# Altium schematic sheet Navigation.SchDoc
size A
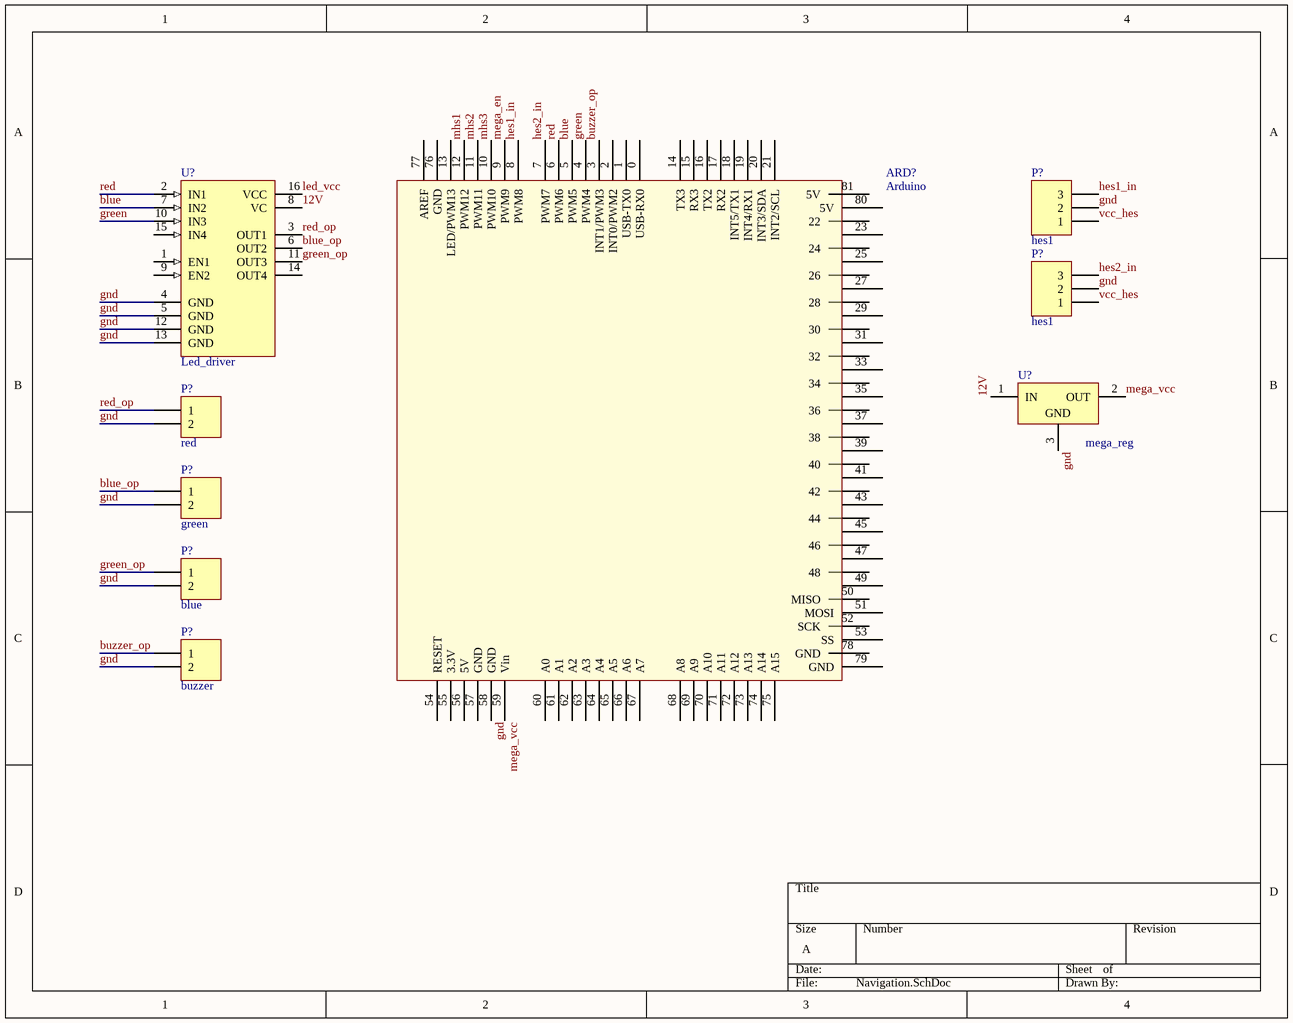
[diagram p0: Navigation.SchDoc]

## Parts
(Parts that share a designator on the sheet are numbered #1, #2 ... from top to bottom, then left to right.)
ARD?  Arduino  [Arduino]
P?#1  hes1  [HDR1X3H]
P?#2  hes1  [HDR1X3H]
P?#3  red  [HDR1X2H]
P?#4  green  [HDR1X2H]
P?#5  blue  [HDR1X2H]
P?#6  buzzer  [HDR1X2H]
U?#1  Led_driver  [DIP16]
U?#2  mega_reg  [TO220ABN]

## Nets
12V: U?#1.8(VC) U?#2.1(IN)
blue: ARD?.5(PWM5) U?#1.7(IN2)
blue_op: P?#4.1 U?#1.6(OUT2)
buzzer_op: ARD?.3(INT1/PWM3) P?#6.1
gnd: ARD?.58(GND) P?#1.2 P?#2.2 P?#3.2 P?#4.2 P?#5.2 P?#6.2 U?#1.4(GND) U?#1.5(GND) U?#1.12(GND) U?#1.13(GND) U?#2.3(GND)
green: ARD?.4(PWM4) U?#1.10(IN3)
green_op: P?#5.1 U?#1.11(OUT3)
hes1_in: ARD?.8(PWM8) P?#1.3
hes2_in: ARD?.7(PWM7) P?#2.3
led_vcc: U?#1.16(VCC)
mega_en: ARD?.9(PWM9)
mega_vcc: ARD?.59(Vin) U?#2.2(OUT)
mhs1: ARD?.12(PWM12)
mhs2: ARD?.11(PWM11)
mhs3: ARD?.10(PWM10)
red: ARD?.6(PWM6) U?#1.2(IN1)
red_op: P?#3.1 U?#1.3(OUT1)
vcc_hes: P?#1.1 P?#2.1

Not connected (* = marked no-connect by the designer): ARD? 0(USB-RX0) 1(USB-TX0) 2(INT0/PWM2) 13(LED/PWM13) 14(TX3) 15(RX3) 16(TX2) 17(RX2) 18(INT5/TX1) 19(INT4/RX1) 20(INT3/SDA) 21(INT2/SCL) 22 23 24 25 26 27 28 29 30 31 32 33 34 35 36 37 38 39 40 41 42 43 44 45 46 47 48 49 50(MISO) 51(MOSI) 52(SCK) 53(SS) 54(RESET) 55(3.3V) 56(5V) 57(GND) 60(A0) 61(A1) 62(A2) 63(A3) 64(A4) 65(A5) 66(A6) 67(A7) 68(A8) 69(A9) 70(A10) 71(A11) 72(A12) 73(A13) 74(A14) 75(A15) 76(GND) 77(AREF) 78(GND) 79(GND) 80(5V) 81(5V); U?#1 1(EN1) 9(EN2) 14(OUT4) 15(IN4)

## Library data of the parts
P?#1 P?#2 = Header 3H: Header, 3-Pin, Right Angle; LatestRevisionDate: 17-Jul-2002; LatestRevisionNote: Re-released for DXP Platform.; Publisher: Altium Limited
P?#3-P?#6 = Header 2H: Header, 2-Pin, Right Angle; LatestRevisionDate: 17-Jul-2002; LatestRevisionNote: Re-released for DXP Platform.; Publisher: Altium Limited
U?#1 = L293D: Push-Pull Four Channel Driver With Diode; Published: 8-Jun-2000; LatestRevisionDate: 06-Jun-2005; LatestRevisionNote: Stylized 3D Model Added.; DatasheetVersion: Jun-1996; PackageVersion: Apr-1996; PackageReference: DIP16; Publisher: Altium Limited; PackageDescription: DIP; 16 Leads; Row Spacing 7.62 mm; Pitch 2.54 mm; ComponentLink1Description: Manufacturer Link; ComponentLink1URL: http://www.st.com/; ComponentLink2Description: Datasheet; ComponentLink2URL: http://www.st.com/stonline/products/literature/ds/1330/l293d.pdf
U?#2 = L7805CV: Positive Voltage Regulator; Note: Tab is connected to pin 3 (GND).; Published: 24-Aug-2001; LatestRevisionDate: 17-Jul-2002; LatestRevisionNote: Re-released for DXP Platform.; DatasheetVersion: Dec-1998; PackageVersion: Jun-1998; PackageReference: TO220ABN; Publisher: Altium Limited; PackageDescription: TO, Thru-Hole, Vertical, Heatsink Mounted; 3 In-Line Leads; Pitch 2.54 mm; Pin sequence 1, 3, 2; ComponentLink1Description: Manufacturer Link; ComponentLink1URL: http://www.st.com/